# Altium schematic sheet DownstreamPort.SchDoc
size Letter; CompanyName: Ploopy Co; Organization: Ploopy Co; Address1: 137-1140 Burnhamthorpe Road W; Address2: Mississauga; Address3: Ontario; Address4: Canada L5C 0A3; DocumentNumber: 5; Revision: R1.001; SheetNumber: 5; SheetTotal: 7
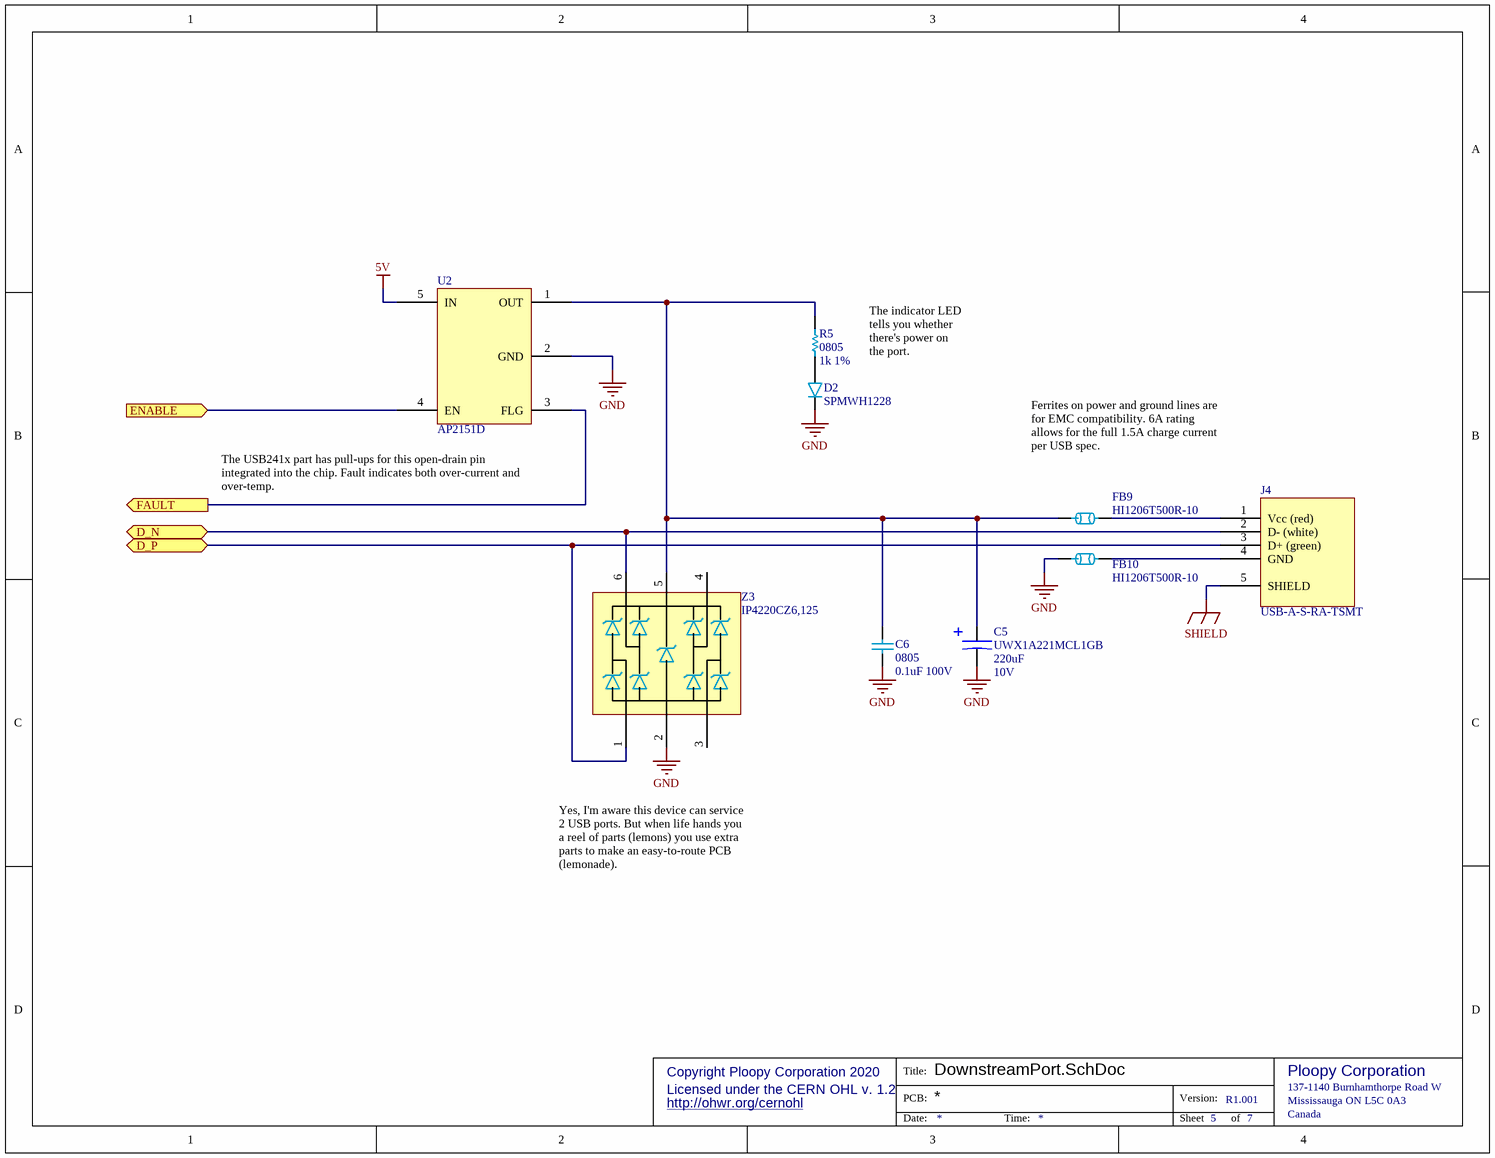
[diagram p0: DownstreamPort.SchDoc]

## Parts
C5  UWX1A221MCL1GB  value 220uF  Voltage: 10V  [Nichicon UWX - 8mm x 5.5mm]
C6  0805  value 0.1uF 100V  [0805]
D2  SPMWH1228  [SPMWH1228]
FB9  HI1206T500R-10  [1206]
FB10  HI1206T500R-10  [1206]
J4  USB-A-S-RA-TSMT  [USB-A-S-RA-TSMT]
R5  0805  value 1k 1%  [0805]
U2  AP2151D  [AP22811 - SOT95P285X140-5M]
Z3  IP4220CZ6,125  [PESD3V3S4UD - SOT95P275X110-6N]

## Ports
D_N (bidir), D_P (bidir), ENABLE (in), FAULT (out)

## Nets
5V: U2.5(IN)
GND: C5.2 C6.1 D2.2(C) FB10.1 U2.2(GND) Z3.2
SHIELD: J4.5(SHIELD)
D_N: J4.2(D-_(white)) Z3.6 ; port D_N
D_P: J4.3(D+_(green)) Z3.1 ; port D_P
ENABLE: U2.4(EN) ; port ENABLE
FAULT: U2.3(FLG) ; port FAULT
NetC5_1: C5.1 C6.2 FB9.1 R5.2 U2.1(OUT) Z3.5
NetD2_1: D2.1(A) R5.1
NetFB9_2: FB9.2 J4.1(Vcc_(red))
NetFB10_2: FB10.2 J4.4(GND)

Not connected (* = marked no-connect by the designer): Z3 3 4

## Notes on the sheet
- The indicator LED tells you whether there's power on the port.
- (near U2) The USB241x part has pull-ups for this open-drain pin integrated into the chip. Fault indicates both over-current and over-temp.
- Ferrites on power and ground lines are for EMC compatibility. 6A rating allows for the full 1.5A charge current per USB spec.
- Yes, I'm aware this device can service 2 USB ports. But when life hands you a reel of parts (lemons) you use extra parts to make an easy-to-route PCB (lemonade).
- Copyright Ploopy Corporation 2020
- Licensed under the CERN OHL v. 1.2
- http://ohwr.org/cernohl
- Title:
- PCB:
- Version:
- Ploopy Corporation
- Mississauga ON L5C 0A3
- 137-1140 Burnhamthorpe Road W
- Date:
- Time:
- Sheet
- of
- Canada

## Library data of the parts
C5 = UWX1A221MCL1GB: 220uF 10V Electrolytic Capacitor, SMD; PNP-Nzl: 6; PNP-dx: 0; PNP-X: 8.3; PNP-Y: 1; PNP-Pt: 2; PNP-Thk: 5.4; PNP-Lv: 26; PNP-TS: 70; PNP-Type: CAP; PNP-FeedType: Tape; PNP-TapeWidth: 16; PNP-TapeIndex: 3; PNP-dy: 0; PNP-A: 0; PNP-W: 0; PNP-Level: 1; PNP-Voff: 0; PNP-PlacePriority: 2; PNP-da: 0; Supplier 1: Digi-Key; Supplier Part Number 1: 493-2098-1-ND
C6 = Cap 0.1uF 100V: 0805, X5R or better; Supplier 1: Digi-Key; Supplier Part Number 1: 1276-6840-2-ND
D2 = SPMWH1228: 3V/0.5W white LED, 2.8mm x 3.5mm; Supplier 2: Digi-Key; Supplier Part Number 2: 1510-1428-1-ND; Supplier 3: Digi-Key; Supplier Part Number 3: 1510-1429-1-ND; Supplier 1: Arrow
FB9 FB10 = HI1206T500R-10: 50 Ohms @ 100MHz 1 Power, Signal Line Ferrite Bead 1206 (3216 Metric) 6A 10mOhm; Value: Ferrite Bead 50R 6A; Supplier 1: Digi-Key; Supplier 2: Mouser; Supplier Part Number 1: 240-2412-1-ND; Supplier Part Number 2: 875-HI1206T500R-10
J4 = USB-A-S-RA-TSMT: USB - A USB 2.0 Receptacle Connector 4 Position Surface Mount, Right Angle; Supplier 1: Digi-Key; Supplier 2: Future Electronics; Supplier 3: Mouser; Supplier Part Number 1: 2057-USB-A-S-RA-TSMT-ND; Supplier Part Number 2: USB-A-S-RA-TSMT-TRAY; Supplier Part Number 3: 490-UJ2-AH-1-SMT-TR
R5 = Res 1k 1% 0805: Chip resistor, 1/8W 100PPM; Supplier 1: Digi-Key; Supplier Part Number 1: RMCF0805FT1K00TR-ND
U2 = AP2151D: USB Power Switch/Driver 500mA SOT-25; Supplier 1: Digi-Key; Supplier 2: Mouser; Supplier Part Number 1: AP2151DWG-7DICT-ND; Supplier Part Number 2: 621-AP2151DWG-7
Z3 = IP4220CZ6,125: TVS DIODE 5.5V 6TSOP (Low capacitance, USB); Supplier 1: Digi-Key; Supplier 2: Mouser; Supplier 3: Arrow; Supplier Part Number 1: 1727-3578-1-ND; Supplier Part Number 2: 771-IP4220CZ6-T/R; Supplier Part Number 3: IP4220CZ6,125